# Altium schematic sheet 输入模块.SchDoc: RC1562L
size A4; Organization: 广东工程职业技术学院; Address1: 邹睿燮; Address2: 4****************9; Address3: 1905420313; SheetNumber: 3; SheetTotal: 4
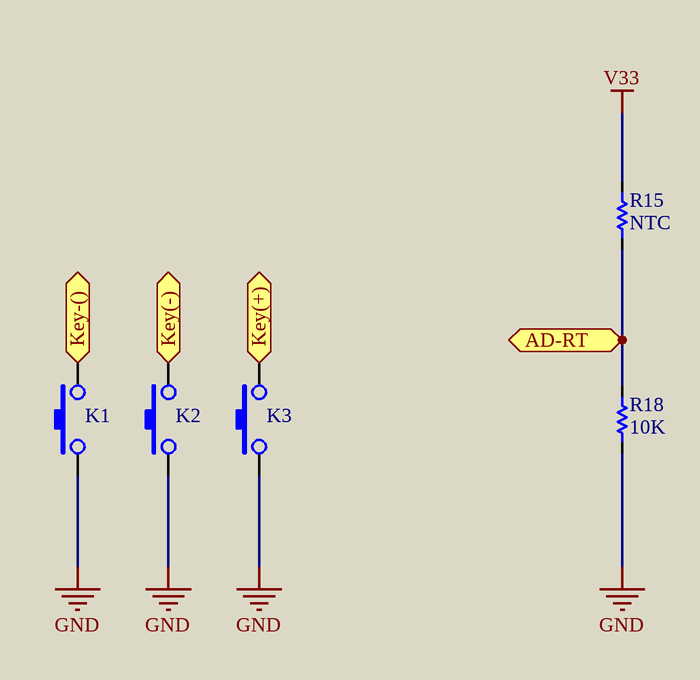
[diagram p0: 输入模块.SchDoc]

## Parts
K1  SW-PB  [4KEY_SMT]  (value not drawn)
K2  SW-PB  [4KEY_SMT]  (value not drawn)
K3  SW-PB  [4KEY_SMT]  (value not drawn)
R15  NTC  [6-0805_L]
R18  10K  [6-0805_L]

## Ports
AD-RT, Key(+), Key(-), Key-()

## Nets
GND: K1.1 K2.1 K3.1 R18.1
V33: R15.2
AD-RT: R15.1 R18.2 ; port AD-RT
Key(+): K3.2 ; port Key(+)
Key(-): K2.2 ; port Key(-)
Key-(): K1.2 ; port Key-()

## Notes on the sheet
- 单位名称
- 考生信息
- 图名
- 文件名
- 第
- 幅
- 总共
- 当前日期
- 当前时间

## Library data of the parts
R15 R18 = Res1_1: Resistor; Published: 8-Jun-2000; LatestRevisionDate: 17-Jul-2002; LatestRevisionNote: Re-released for DXP Platform.; PackageReference: AXIAL-0.3; Publisher: Altium Limited; PackageDescription: Axial Device, Thru-Hole; 2 Leads; 0.3 in Pin Spacing